# Altium project STM32F4DiscoveryDisplay.PrjPCB
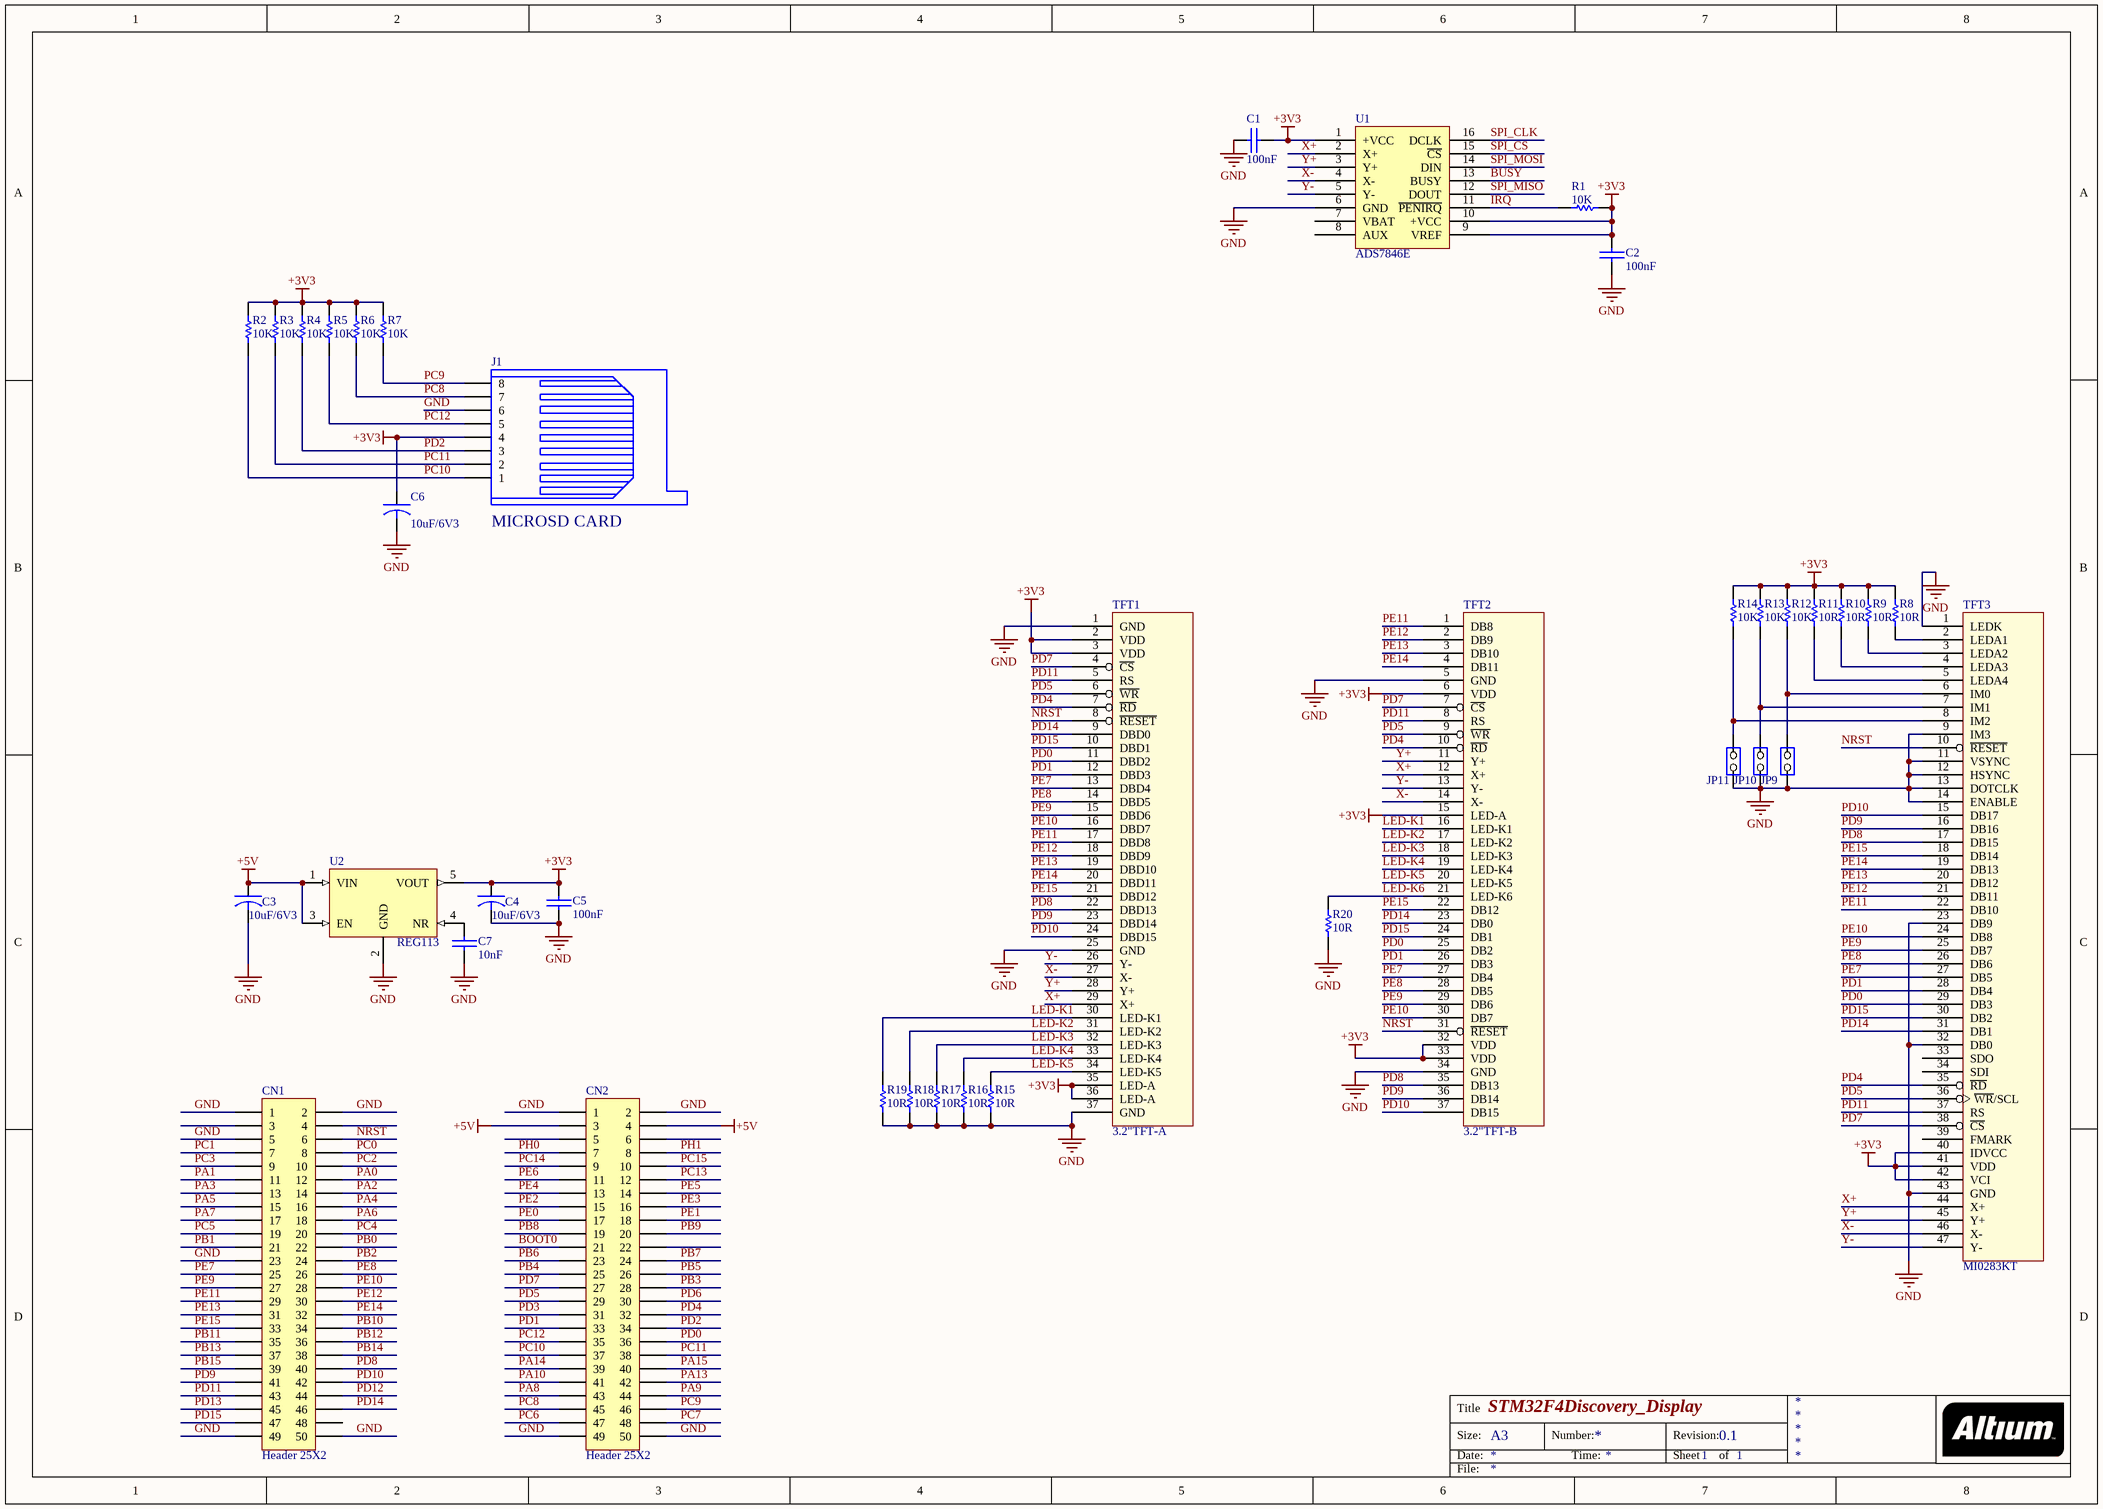
[diagram p0: STM32F4DD.SchDoc]
1 sheet, 38 parts. Net scope: global (net labels, ports and power ports of the same name join across sheets).
Board files: STM32F4DD.PcbDoc, STM32F4DISCOVERY_PCB_3D.PcbDoc

## Sheet STM32F4DD.SchDoc: STM32F4Discovery_Display
size A3; Revision: 0.1; SheetNumber: 1; SheetTotal: 1; PageSetup: Record=PageOptions|CenterHorizontal=True|CenterVertical=True|PrintScale=0.73|XCorrection=1.00|YCorrection=1.00|PrintKind=0|BorderSize=5000000|LeftOffset=0|BottomOffset=0|Orientation=2|PaperLength=1000|PaperWidth=1000|Scale=100|PaperSource=7|PrintQuality=-4|MediaType=1|DitherType=10|PaperKind=A3 297 x 420 ÁÁ.|PrintScaleMode=1

### Parts
C1  100nF  [CAPC1608N]
C2  100nF  [CAPC1608N]
C3  10uF/6V3  [TC3528-1411]
C4  10uF/6V3  [TC3528-1411]
C5  100nF  [CAPC1608N]
C6  10uF/6V3  [TC3528-1411]
C7  10nF  [CAPC1608N]
CN1  Header 25X2  [HDR2X25-TH-SMD]
CN2  Header 25X2  [HDR2X25-TH-SMD]
J1  TFMS08TK-PP  [MEM2060]  (value not drawn)
JP9  (no value)  [Solder Jumper - NO]
JP10  (no value)  [Solder Jumper - NO]
JP11  (no value)  [Solder Jumper - NO]
R1  10K  [RESC1608N]
R2  10K  [RESC1608N]
R3  10K  [RESC1608N]
R4  10K  [RESC1608N]
R5  10K  [RESC1608N]
R6  10K  [RESC1608N]
R7  10K  [RESC1608N]
R8  10R  [RESC1608N]
R9  10R  [RESC1608N]
R10  10R  [RESC1608N]
R11  10R  [RESC1608N]
R12  10K  [RESC1608N]
R13  10K  [RESC1608N]
R14  10K  [RESC1608N]
R15  10R  [RESC1608N]
R16  10R  [RESC1608N]
R17  10R  [RESC1608N]
R18  10R  [RESC1608N]
R19  10R  [RESC1608N]
R20  10R  [RESC1608N]
TFT1  3.2"TFT-A  [LCD-KWH032Q01-F03]
TFT2  3.2"TFT-B  [LCD-KWH032GM02-F05]
TFT3  MI0283KT  [MI0283KT]
U1  ADS7846E  [SSOP16]
U2  REG113  [SOT95P280X145-5N]

### Nets
+3V3: C1.2 C2.1 C4.1 C5.2 C6.1 J1.4 R1.2 R2.2 R3.2 R4.2 R5.2 R6.2 R7.2 R8.1 R9.1 R10.1 R11.1 R12.2 R13.2 R14.2 TFT1.2(VDD) TFT1.3(VDD) TFT1.35(LED-A) TFT1.36(LED-A) TFT2.6(VDD) TFT2.15(LED-A) TFT2.32(VDD) TFT2.33(VDD) TFT3.40(IDVCC) TFT3.41(VDD) TFT3.42(VCI) U1.1(+VCC) U1.9(VREF) U1.10(+VCC) U2.5(VOUT)
+5V: C3.1 CN2.3 CN2.4 U2.1(VIN) U2.3(EN)
GND: C1.1 C2.2 C3.2 C4.2 C5.1 C6.2 C7.2 CN1.1 CN1.2 CN1.5 CN1.23 CN1.49 CN1.50 CN2.1 CN2.2 CN2.49 CN2.50 J1.6 JP9.1(COMMON) JP10.1(COMMON) JP11.1(COMMON) R15.1 R16.1 R17.1 R18.1 R19.1 R20.1 TFT1.1(GND) TFT1.25(GND) TFT1.37(GND) TFT2.5(GND) TFT2.34(GND) TFT3.1(LEDK) TFT3.9(IM3) TFT3.11(VSYNC) TFT3.12(HSYNC) TFT3.13(DOTCLK) TFT3.14(ENABLE) TFT3.23(DB9) TFT3.32(DB0) TFT3.43(GND) U1.6(GND) U2.2(GND)
BOOT0: CN2.21
BUSY: U1.13(BUSY)
IRQ: R1.1 U1.11(~{PENIRQ})
LED-K1: R19.2 TFT1.30(LED-K1) TFT2.16(LED-K1)
LED-K2: R18.2 TFT1.31(LED-K2) TFT2.17(LED-K2)
LED-K3: R17.2 TFT1.32(LED-K3) TFT2.18(LED-K3)
LED-K4: R16.2 TFT1.33(LED-K4) TFT2.19(LED-K4)
LED-K5: R15.2 TFT1.34(LED-K5) TFT2.20(LED-K5)
LED-K6: R20.2 TFT2.21(LED-K6)
NRST: CN1.6 TFT1.8(~{RESET}) TFT2.31(~{RESET}) TFT3.10(~{RESET})
PA0: CN1.12
PA1: CN1.11
PA2: CN1.14
PA3: CN1.13
PA4: CN1.16
PA5: CN1.15
PA6: CN1.18
PA7: CN1.17
PA8: CN2.43
PA9: CN2.44
PA10: CN2.41
PA13: CN2.42
PA14: CN2.39
PA15: CN2.40
PB0: CN1.22
PB1: CN1.21
PB2: CN1.24
PB3: CN2.28
PB4: CN2.25
PB5: CN2.26
PB6: CN2.23
PB7: CN2.24
PB8: CN2.19
PB9: CN2.20
PB10: CN1.34
PB11: CN1.35
PB12: CN1.36
PB13: CN1.37
PB14: CN1.38
PB15: CN1.39
PC0: CN1.8
PC1: CN1.7
PC2: CN1.10
PC3: CN1.9
PC4: CN1.20
PC5: CN1.19
PC6: CN2.47
PC7: CN2.48
PC8: CN2.45 J1.7 R6.1
PC9: CN2.46 J1.8 R7.1
PC10: CN2.37 J1.1 R2.1
PC11: CN2.38 J1.2 R3.1
PC12: CN2.35 J1.5 R5.1
PC13: CN2.12
PC14: CN2.9
PC15: CN2.10
PD0: CN2.36 TFT1.11(DBD2) TFT2.25(DB2) TFT3.29(DB3)
PD1: CN2.33 TFT1.12(DBD3) TFT2.26(DB3) TFT3.28(DB4)
PD2: CN2.34 J1.3 R4.1
PD3: CN2.31
PD4: CN2.32 TFT1.7(~{RD}) TFT2.10(~{RD}) TFT3.35(~{RD})
PD5: CN2.29 TFT1.6(~{WR}) TFT2.9(~{WR}) TFT3.36(~{WR}/SCL)
PD6: CN2.30
PD7: CN2.27 TFT1.4(~{CS}) TFT2.7(~{CS}) TFT3.38(~{CS})
PD8: CN1.40 TFT1.22(DBD13) TFT2.35(DB13) TFT3.17(DB15)
PD9: CN1.41 TFT1.23(DBD14) TFT2.36(DB14) TFT3.16(DB16)
PD10: CN1.42 TFT1.24(DBD15) TFT2.37(DB15) TFT3.15(DB17)
PD11: CN1.43 TFT1.5(RS) TFT2.8(RS) TFT3.37(RS)
PD12: CN1.44
PD13: CN1.45
PD14: CN1.46 TFT1.9(DBD0) TFT2.23(DB0) TFT3.31(DB1)
PD15: CN1.47 TFT1.10(DBD1) TFT2.24(DB1) TFT3.30(DB2)
PE0: CN2.17
PE1: CN2.18
PE2: CN2.15
PE3: CN2.16
PE4: CN2.13
PE5: CN2.14
PE6: CN2.11
PE7: CN1.25 TFT1.13(DBD4) TFT2.27(DB4) TFT3.27(DB5)
PE8: CN1.26 TFT1.14(DBD5) TFT2.28(DB5) TFT3.26(DB6)
PE9: CN1.27 TFT1.15(DBD6) TFT2.29(DB6) TFT3.25(DB7)
PE10: CN1.28 TFT1.16(DBD7) TFT2.30(DB7) TFT3.24(DB8)
PE11: CN1.29 TFT1.17(DBD8) TFT2.1(DB8) TFT3.22(DB10)
PE12: CN1.30 TFT1.18(DBD9) TFT2.2(DB9) TFT3.21(DB11)
PE13: CN1.31 TFT1.19(DBD10) TFT2.3(DB10) TFT3.20(DB12)
PE14: CN1.32 TFT1.20(DBD11) TFT2.4(DB11) TFT3.19(DB13)
PE15: CN1.33 TFT1.21(DBD12) TFT2.22(DB12) TFT3.18(DB14)
PH0: CN2.7
PH1: CN2.8
SPI_CLK: U1.16(DCLK)
SPI_CS: U1.15(~{CS})
SPI_MISO: U1.12(DOUT)
SPI_MOSI: U1.14(DIN)
X+: TFT1.29(X+) TFT2.12(X+) TFT3.44(X+) U1.2(X+)
X-: TFT1.27(X-) TFT2.14(X-) TFT3.46(X-) U1.4(X-)
Y+: TFT1.28(Y+) TFT2.11(Y+) TFT3.45(Y+) U1.3(Y+)
Y-: TFT1.26(Y-) TFT2.13(Y-) TFT3.47(Y-) U1.5(Y-)
NetC7_1: C7.1 U2.4(NR)
NetJP9_2: JP9.2(NO) R12.1 TFT3.6(IM0)
NetJP10_2: JP10.2(NO) R13.1 TFT3.7(IM1)
NetJP11_2: JP11.2(NO) R14.1 TFT3.8(IM2)
NetR8_2: R8.2 TFT3.2(LEDA1)
NetR9_2: R9.2 TFT3.3(LEDA2)
NetR10_2: R10.2 TFT3.4(LEDA3)
NetR11_2: R11.2 TFT3.5(LEDA4)

Not connected (* = marked no-connect by the designer): CN1 3 4 48; CN2 5 6 22; TFT3 33(SDO) 34(SDI) 39(FMARK); U1 7(VBAT) 8(AUX)

### Notes on the sheet
- (near J1) MICROSD CARD
- Title
- Size:
- Date:
- A3
- Number:
- Time:
- Revision:
- Sheet
- of
- File:

### Library data of the parts
C1 C2 C5 = CAP: Capacitor
C3 C4 C6 = CAPACITOR: Manufacturer: VISHAY SPRAGUE; P/N: 293D106X06R3B2TE3; Price: 14.58; Supplier: Farnell
C7 = CAP: Capacitor 10nF
CN1 CN2 = Header 25X2: Header, 25-Pin, Dual row; LatestRevisionDate: 17-Jul-2002; LatestRevisionNote: Re-released for DXP Platform.; Publisher: Altium Limited
J1 = SMS016AFA5E: MICRO SD CARD CONNECTOR, PUSH/PUSH TYPE; Link: http://www.es.co.th/detail.asp?Prod=00710703
JP9-JP11 = JP2: BOARD-BOARD CONNECTOR HEADER, 2WAY, 1ROW; Manufacturer: GCT; P/N: BF020-02-A-B-0400-0300-N-G; Price: 6.68; Supplier: Farnell
R1 R12-R14 = Res1: Resistor; Value: 1K; Published: 8-Jun-2000; LatestRevisionDate: 17-Jul-2002; LatestRevisionNote: Re-released for DXP Platform.; PackageReference: AXIAL-0.3; Publisher: Altium Limited
R2-R11 R15-R20 = Res1: Resistor; Published: 8-Jun-2000; LatestRevisionDate: 17-Jul-2002; LatestRevisionNote: Re-released for DXP Platform.; PackageReference: AXIAL-0.3; Publisher: Altium Limited
  R2-R7: Value: 10K
  R8-R11 R15-R20: Value: 10R
TFT3 = MI0283KT: TFT-G240320UTSW-92W-TP-E
U1 = ADS7846E: TOUCH SCREEN CONTROLLER 2.2V TO 5.25V OPERATION
U2 = REG113: DMOS  400mA Low-Dropout Regulator